# EAGLE design arm-adaptor (EAGLE 6.2)
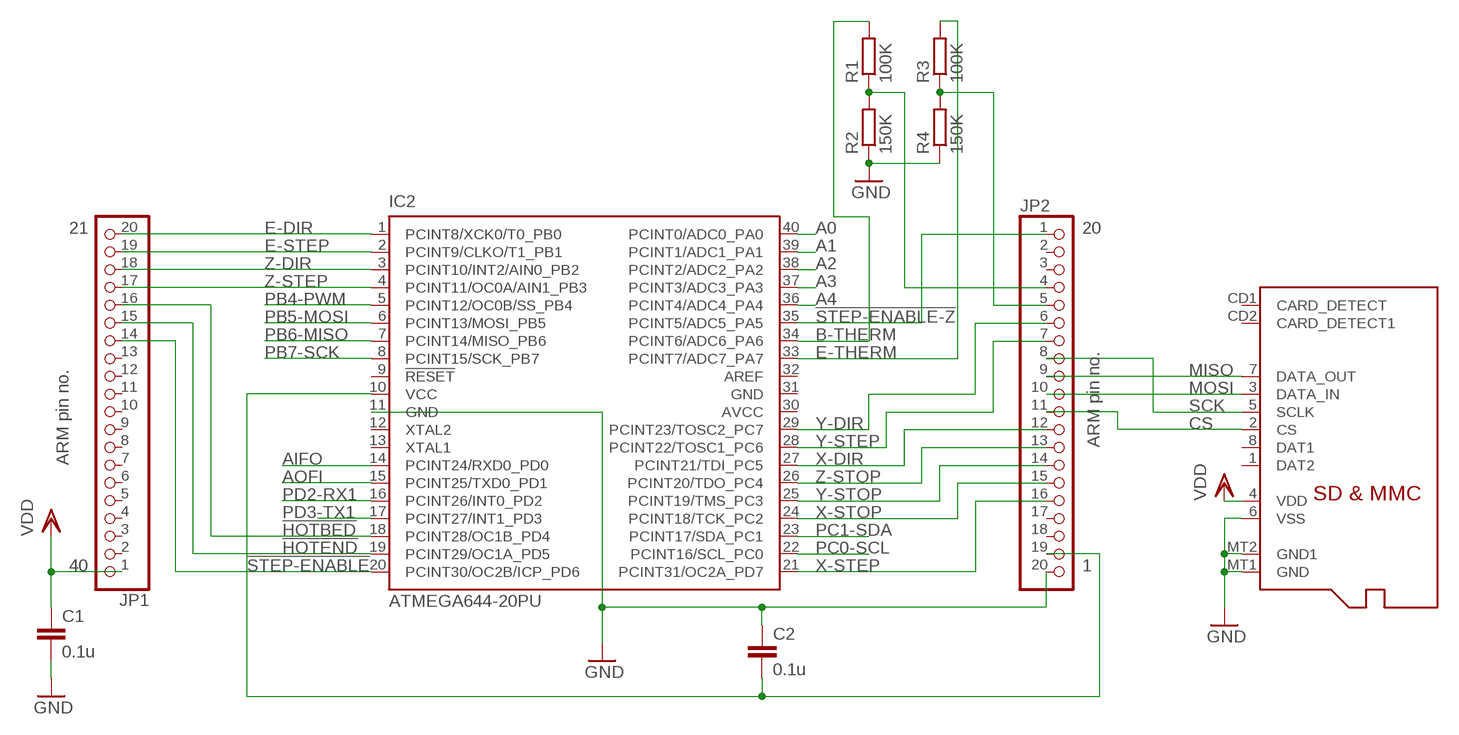
[diagram p0: schematic, sheet 1]

## Parts
C1  0.1u  C-EU025-024X044  [C025-024X044]
C2  0.1u  C-EU025-024X044  [C025-024X044]
IC2  ATMEGA644-20PU  [DIL40]
JP1  PINHD-1X20  [1X20]
JP2  PINHD-1X20  [1X20]
R1  100K  R-EU_0204/5  [0204/5]
R2  150K  R-EU_0204/5  [0204/5]
R3  100K  R-EU_0204/5  [0204/5]
R4  150K  R-EU_0204/5  [0204/5]
X1  MICROSD  [MICROSD]

## Nets
!HOTBED: IC2.18(PCINT28/OC1B_PD4) JP1.16
!HOTEND: IC2.19(PCINT29/OC1A_PD5) JP1.15
!STEP-ENABLE: IC2.20(PCINT30/OC2B/ICP_PD6) JP1.14
!STEP-ENABLE-Z: IC2.35(PCINT5/ADC5_PA5) JP2.1
A0: IC2.40(PCINT0/ADC0_PA0)
A1: IC2.39(PCINT1/ADC1_PA1)
A2: IC2.38(PCINT2/ADC2_PA2)
A3: IC2.37(PCINT3/ADC3_PA3)
A4: IC2.36(PCINT4/ADC4_PA4)
AIFO: IC2.14(PCINT24/RXD0_PD0)
AOFI: IC2.15(PCINT25/TXD0_PD1)
B-THERM: IC2.34(PCINT6/ADC6_PA6) R1.2
CS: JP2.11 X1.2(CS)
E-DIR: IC2.1(PCINT8/XCK0/T0_PB0) JP1.20
E-STEP: IC2.2(PCINT9/CLKO/T1_PB1) JP1.19
E-THERM: IC2.33(PCINT7/ADC7_PA7) R3.2
GND [power]: C1.2 C2.1 IC2.11(GND) JP2.20 R2.1 R4.1 X1.6(VSS) X1.MT1(GND) X1.MT2(GND1)
MISO: JP2.9 X1.7(DATA_OUT)
MOSI: JP2.10 X1.3(DATA_IN)
N$1: JP2.4 R1.1 R2.2
N$2: JP2.5 R3.1 R4.2
PB4-PWM: IC2.5(PCINT12/OC0B/SS_PB4)
PB5-MOSI: IC2.6(PCINT13/MOSI_PB5)
PB6-MISO: IC2.7(PCINT14/MISO_PB6)
PB7-SCK: IC2.8(PCINT15/SCK_PB7)
PC0-SCL: IC2.22(PCINT16/SCL_PC0)
PC1-SDA: IC2.23(PCINT17/SDA_PC1)
PD2-RX1: IC2.16(PCINT26/INT0_PD2)
PD3-TX1: IC2.17(PCINT27/INT1_PD3)
SCK: JP2.8 X1.5(SCLK)
VDD: C1.1 JP1.1 X1.4(VDD)
VIN: C2.2 IC2.10(VCC) JP2.19
X-DIR: IC2.27(PCINT21/TDI_PC5) JP2.12
X-STEP: IC2.21(PCINT31/OC2A_PD7) JP2.16
X-STOP: IC2.24(PCINT18/TCK_PC2) JP2.15
Y-DIR: IC2.29(PCINT23/TOSC2_PC7) JP2.6
Y-STEP: IC2.28(PCINT22/TOSC1_PC6) JP2.7
Y-STOP: IC2.25(PCINT19/TMS_PC3) JP2.14
Z-DIR: IC2.3(PCINT10/INT2/AIN0_PB2) JP1.18
Z-STEP: IC2.4(PCINT11/OC0A/AIN1_PB3) JP1.17
Z-STOP: IC2.26(PCINT20/TDO_PC4) JP2.13
Unconnected: IC2.9(!RESET) IC2.12(XTAL2) IC2.13(XTAL1) IC2.32(AREF) JP1.2 JP1.3 JP1.4 JP1.5 JP1.6 JP1.7 JP1.8 JP1.9 JP1.10 JP1.11 JP1.12 JP1.13 JP2.2 JP2.3 JP2.17 JP2.18 X1.1(DAT2) X1.8(DAT1) X1.CD1(CARD_DETECT) X1.CD2(CARD_DETECT1)

## Notes on the sheet
- 21 | 20
- ARM pin no.
- ARM pin no.
- 40 | 1

## Power pins joined to a net without a drawn wire
AVCC: IC2.30(AVCC)
GND: IC2.31(GND)

## Library data of the parts
C1 C2 = rcl:C-EU: CAPACITOR, European symbol
IC2 = atmel:ATMEGA644-*PU: 8-bit Microcontroller with 64K Bytes In-System Programmable Flash Auto generated by make-symbol-device-package-bsdl.ulp Rev. 34 Source: http://www.atmel.com/dyn/resources/prod_documents/doc2593.pdf; MPN: ATMEGA644-20PU; OC_FARNELL: 1288340; OC_NEWARK: 23M5060
JP1 JP2 = pinhead:PINHD-1X20: PIN HEADER
R1-R4 = rcl:R-EU_: RESISTOR, European symbol
X1 = adafruit:MICROSD: Micro-SD / Transflash card holder with SPI pinout For the 3M # 2908-05WB-MG and/or 4UCON #19656 push-push type

## Board
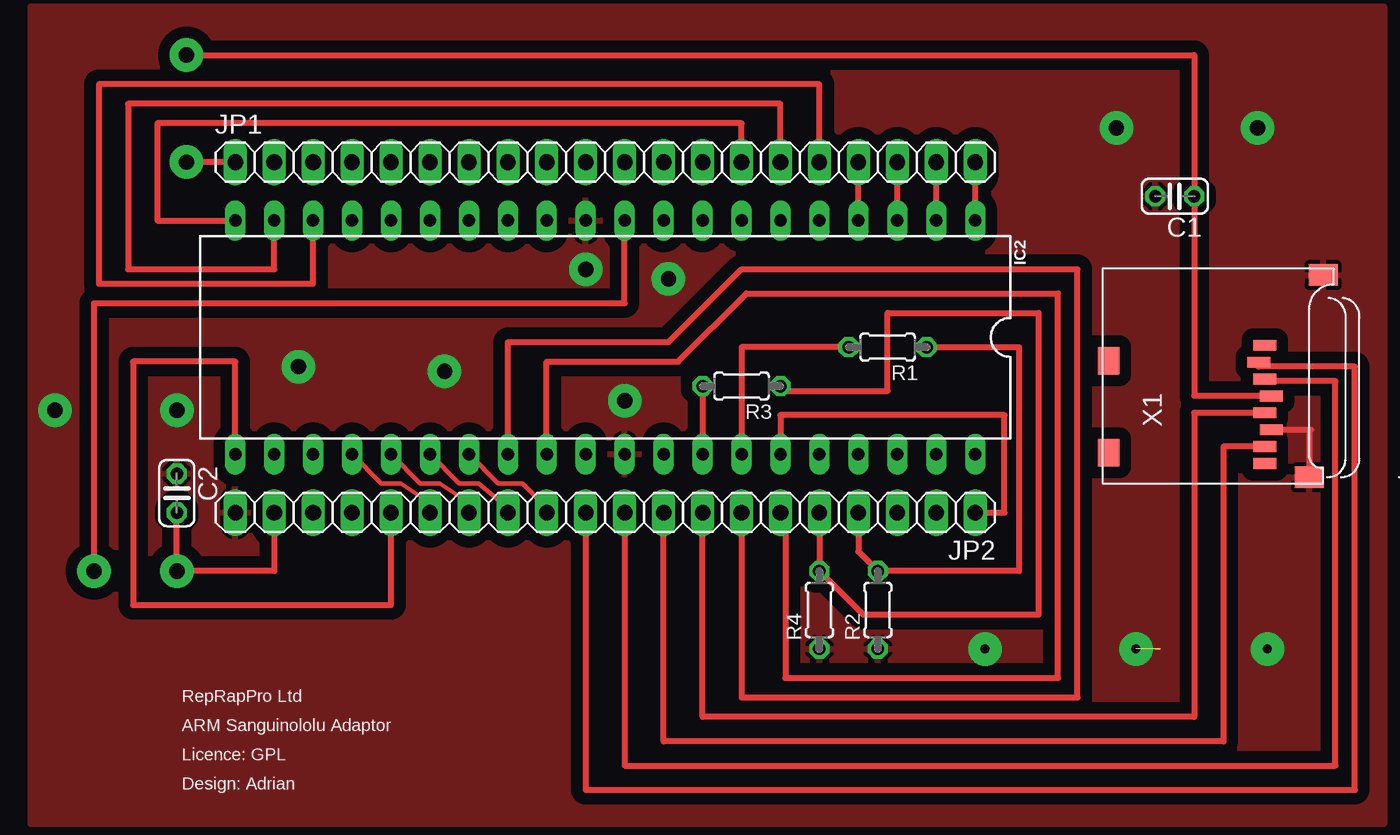
[diagram p1: board, top side]
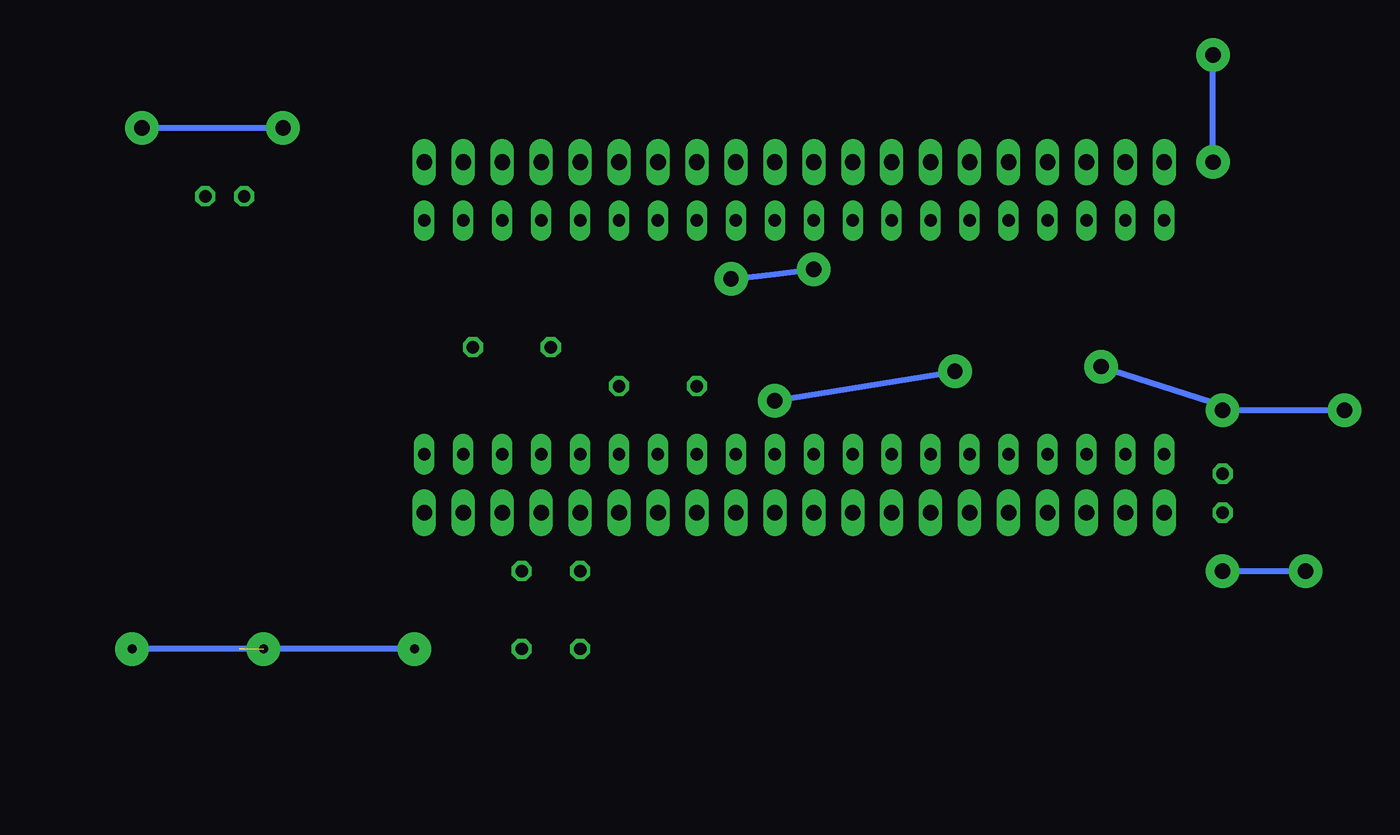
[diagram p2: board, bottom side, seen from below]

No outline drawn. Coordinates in mm, seen from the top.
Copper layers (1*16): Top 0.035mm / dielectric 1.5mm / Bottom 0.035mm
Design rules "default": minimum track width 10mil, minimum drill 20mil, track to track 30mil, track to pad 30mil, pad to pad 30mil, via to via 30mil, smd to smd 0mil, copper to edge 10mil, drill to drill 10mil, minimum pad ring 10mil, minimum via ring 10mil, stop-mask expansion 2mil, vias tented up to drill 25mil, thermal gap 10mil

### Footprints (pad centres in the part's own frame; a part is rotated, then mirrored left to right if it is on the bottom)
C025-024X044 = drill 0.813 octagon: 1 -1.27,0; 2 1.27,0
DIL40 = drill 0.813 long: 1 -24.13,-7.62; 2 -21.59,-7.62; 3 -19.05,-7.62; 4 -16.51,-7.62; 5 -13.97,-7.62; 6 -11.43,-7.62; 7 -8.89,-7.62; 8 -6.35,-7.62; 9 -3.81,-7.62; 10 -1.27,-7.62; 11 1.27,-7.62; 12 3.81,-7.62; 13 6.35,-7.62; 14 8.89,-7.62; 15 11.43,-7.62; 16 13.97,-7.62; 17 16.51,-7.62; 18 19.05,-7.62; 19 21.59,-7.62; 20 24.13,-7.62; 21 24.13,7.62; 22 21.59,7.62; 23 19.05,7.62; 24 16.51,7.62; 25 13.97,7.62; 26 11.43,7.62; 27 8.89,7.62; 28 6.35,7.62; 29 3.81,7.62; 30 1.27,7.62; 31 -1.27,7.62; 32 -3.81,7.62; 33 -6.35,7.62; 34 -8.89,7.62; 35 -11.43,7.62; 36 -13.97,7.62; 37 -16.51,7.62; 38 -19.05,7.62; 39 -21.59,7.62; 40 -24.13,7.62
1X20 = drill 1.016 long: 1 -24.13,0; 2 -21.59,0; 3 -19.05,0; 4 -16.51,0; 5 -13.97,0; 6 -11.43,0; 7 -8.89,0; 8 -6.35,0; 9 -3.81,0; 10 -1.27,0; 11 1.27,0; 12 3.81,0; 13 6.35,0; 14 8.89,0; 15 11.43,0; 16 13.97,0; 17 16.51,0; 18 19.05,0; 19 21.59,0; 20 24.13,0
0204/5 = drill 0.813 octagon: 1 -2.54,0; 2 2.54,0
MICROSD = smd 0.7 x 1.5: 1 9,-10.64; 2 7.9,-10.24; 3 6.8,-10.64; 4 5.7,-11.04; 5 4.6,-10.64; 6 3.5,-11.04; 7 2.4,-10.64; 8 1.3,-10.64 | smd 1.8 x 1.4: CD1 2,-0.44; CD2 8,-0.44 | smd 1.4 x 1.9: MT1 0.4,-13.54; MT2 13.6,-14.44

### Placement (x,y rotation side)
C1  70.17,39.69 180 top
C2  5.08,20.32 270 top
IC2  33.02,30.48 180 top
JP1  33.02,41.91 0 top
JP2  33.02,19.05 180 top
R1  51.44,29.84 180 top
R2  50.8,12.7 90 top
R3  41.91,27.3 180 top
R4  46.99,12.7 90 top
X1  65.41,20.95 90 top

### Tracks (layer width: path | path; a pad name or v marks a point on that pad's centre or on a via)
!HOTBED
  Top 0.406: JP1.16 46.99,46.99 0,46.99 0,33.97 13.97,33.97 IC2.18
!HOTEND
  Top 0.406: JP1.15 44.45,45.72 1.91,45.72 1.91,34.92 11.43,34.92 IC2.19
!STEP-ENABLE
  Top 0.406: JP1.14 41.91,44.45 3.81,44.45 3.81,38.1 IC2.20
!STEP-ENABLE-Z
  Top 0.406: JP2.1 59.05,19.05 59.05,25.4 44.45,25.4 IC2.35
B-THERM
  Top 0.406: R1.2 41.91,29.84 IC2.34
CS
  Top 0.406: JP2.11 31.75,0.95 81.92,0.95 81.92,28.57 75.64,28.57 X1.2
E-DIR
  Top 0.406: IC2.1 JP1.20
E-STEP
  Top 0.406: IC2.2 JP1.19
E-THERM
  Top 0.406: R3.2 IC2.33
GND  (via drill 0.6 pad 2.18, 1 pad 2.18)  (3 unrouted)
  Top 0.406: 79.06,21.36 X1.MT1 78.94,24.45 79.06,24.45 X1.6
  Bottom 0.406: v5.08,25.72 4.76,26.04 | v37.15,34.29 34.29,34.61 v31.75,34.92 | v66.36,44.13 v75.56,44.13 | v34.29,26.35 v22.54,28.26 | v13.02,28.57 5.08,26.04 v5.08,25.72 | v-2.86,25.72 v5.08,25.72 | v57.78,10.16 v67.63,10.16 | v67.63,10.16 v76.2,10.16 | v67.63,10.16 67.63,9.84
  pour Top: -4.45,52.07 83.82,52.07 83.82,-1.27 -4.45,-1.27
MISO
  Top 0.406: X1.7 73.34,23.36 73.34,4.13 36.83,4.13 JP2.9
MOSI
  Top 0.406: JP2.10 34.29,2.54 80.64,2.54 80.64,27.62 76.05,27.62 X1.3
N$1
  Top 0.406: JP2.4 49.53,16.51 R2.2 60.01,15.24 60.01,29.84 R1.1
N$2
  Top 0.406: JP2.5 R4.2 49.85,12.38 61.28,12.38 61.28,32.07 51.44,32.07 51.44,26.99 44.45,26.99 R3.1
SCK
  Top 0.406: X1.5 71.44,25.55 71.44,5.71 39.37,5.71 JP2.8
VDD  (via drill 1 pad 2.18)
  Top 0.406: JP1.1 v5.71,41.91 | v5.71,48.9 71.44,48.9 C1.1 71.44,26.66 X1.4
  Bottom 0.406: v5.71,41.91 v5.71,48.9
VIN  (via drill 1 pad 2.18)
  Top 0.406: JP2.19 11.43,15.24 v5.08,15.24 C2.2 | v-0.32,15.24 -0.32,32.7 34.29,32.7 IC2.10
  Bottom 0.406: v5.08,15.24 v-0.32,15.24
X-DIR
  Top 0.305: JP2.12 29.21,19.37 27.62,20.95 26.04,20.95 IC2.27
X-STEP
  Top 0.406: IC2.21 8.89,28.89 2.22,28.89 2.22,13.02 19.05,13.02 JP2.16
X-STOP
  Top 0.305: JP2.15 21.59,19.68 19.68,20.95 18.41,20.95 IC2.24
Y-DIR
  Top 0.406: JP2.6 44.77,19.05 44.77,8.26 62.55,8.26 62.55,33.34 42.23,33.34 37.78,28.89 29.21,28.89 IC2.29
Y-STEP
  Top 0.406: JP2.7 41.91,6.99 63.82,6.99 63.82,34.92 41.91,34.92 37.15,30.16 26.67,30.16 IC2.28
Y-STOP
  Top 0.305: JP2.14 24.13,19.68 22.23,20.95 20.95,20.95 IC2.25
Z-DIR
  Top 0.406: IC2.3 JP1.18
Z-STEP
  Top 0.406: IC2.4 JP1.17
Z-STOP
  Top 0.305: JP2.13 26.67,19.37 24.77,20.95 23.5,20.95 IC2.26

### Text on the board
tNames: RepRapPro Ltd | ARM Sanguinololu Adaptor | Licence: GPL | Design: Adrian